# EAGLE design whare hauora sensor r1.2 (EAGLE 7.6.0)
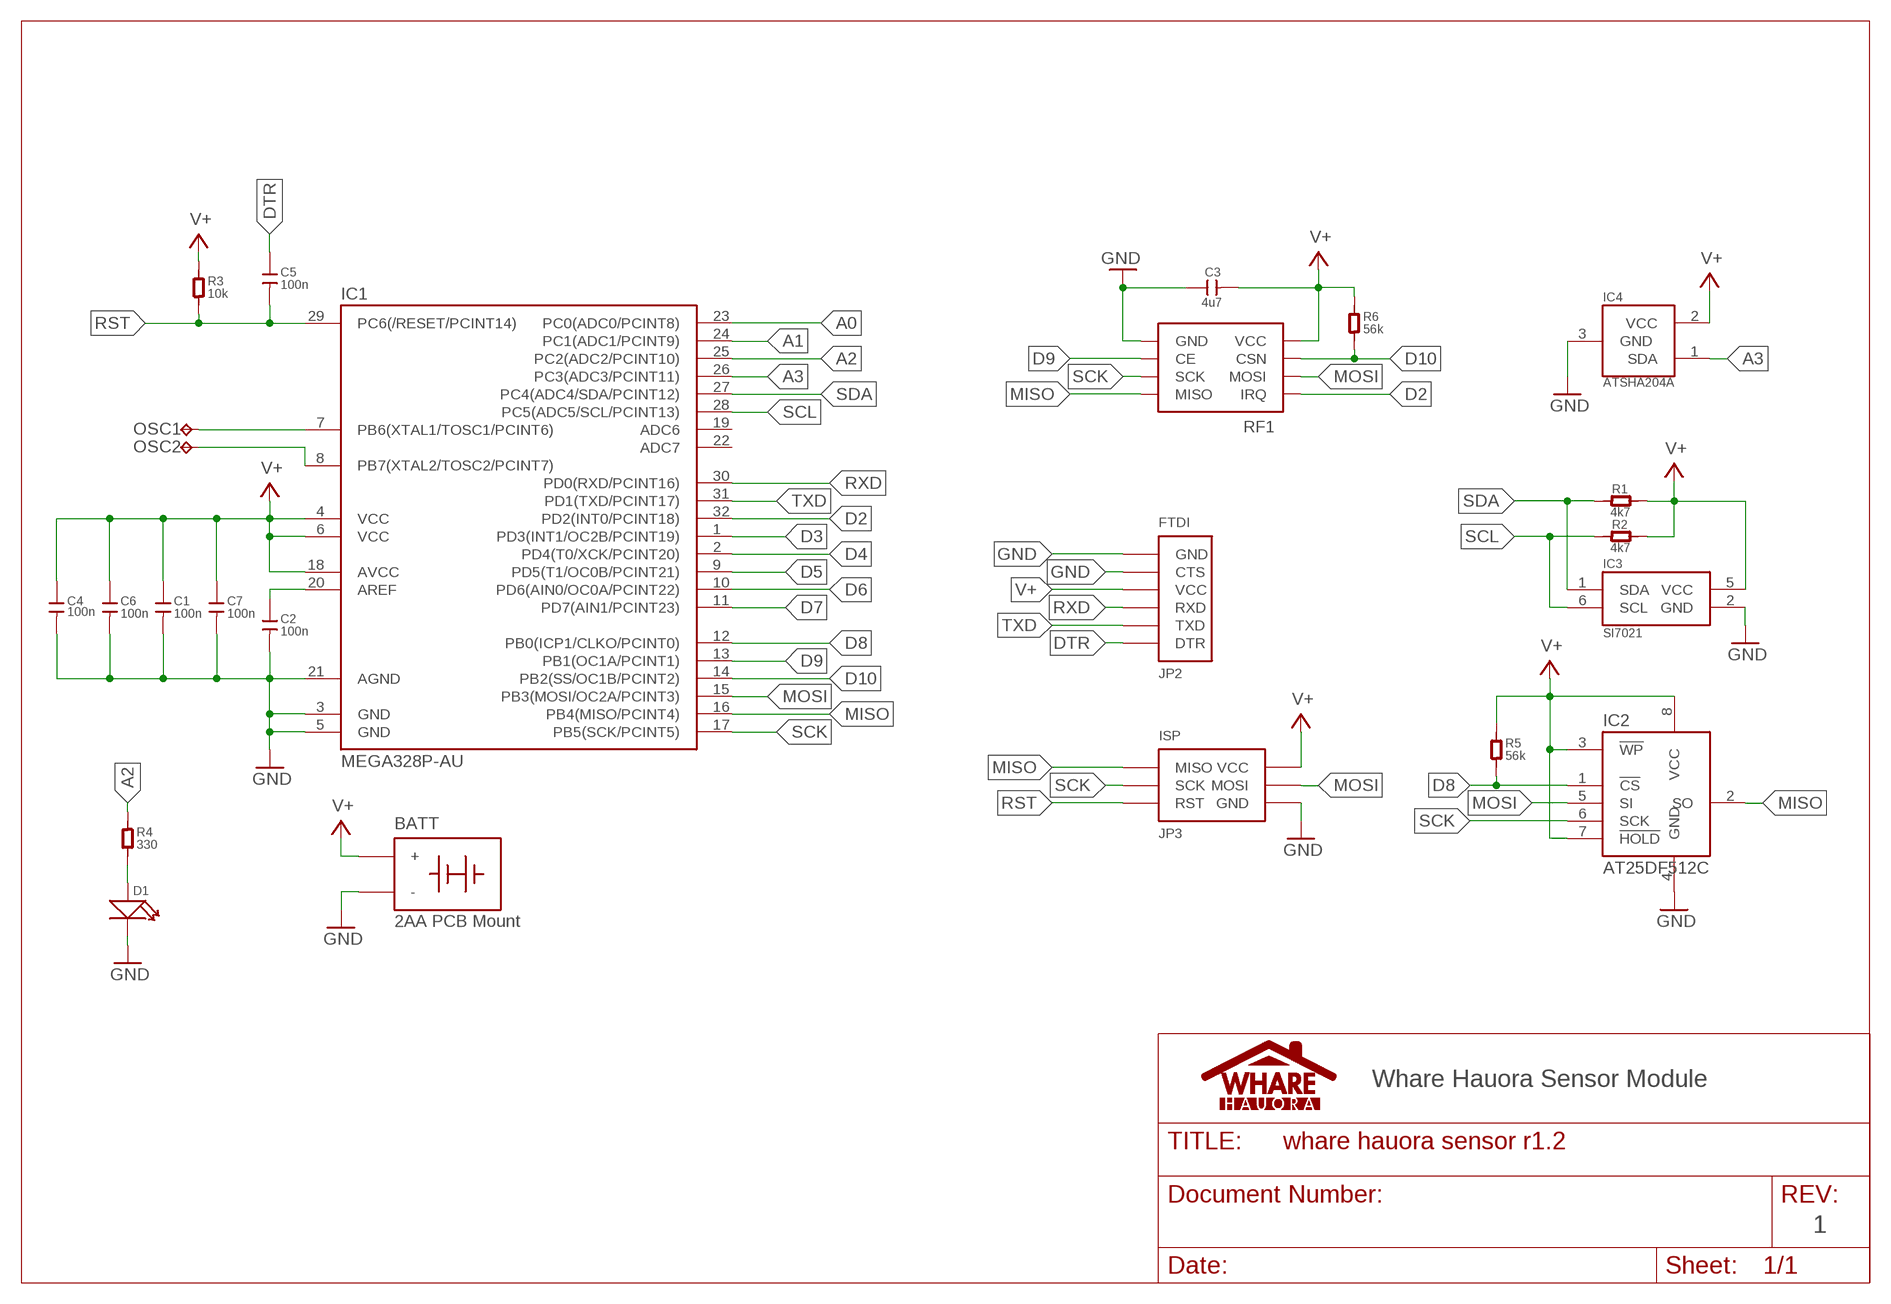
[diagram p0: schematic, sheet 1]

## Parts
BATT  2AA-PACK  [2AA-PACK\]
C1  100n  CAP-0603  [C0603]
C2  100n  CAP-0603  [C0603]
C3  4u7  CAP-0603  [C0603]
C4  100n  CAP-0603  [C0603]
C5  100n  CAP-0603  [C0603]
C6  100n  CAP-0603  [C0603]
C7  100n  CAP-0603  [C0603]
D1  LED-0603  [LED-0603]
IC1  MEGA328P-AU  MEGA48/88/168-AU  [TQFP32-08]
IC2  AT25DF512C  [SO8]
IC3  SI7021  [DFN6]
IC4  ATSHA204A  [SOT23]
JP2  FTDI  [FTDI]
JP3  ISP  [ISP]
OSC1  TPTP10R  [TP10R]
OSC2  TPTP10R  [TP10R]
R1  4k7  R-0603  [R0603]
R2  4k7  R-0603  [R0603]
R3  10k  R-0603  [R0603]
R4  330  R-0603  [R0603]
R5  56k  R-0603  [R0603]
R6  56k  R-0603  [R0603]
RF1  NRF24L01+  [NRF24L01+]

## Nets
A0: IC1.23(PC0(ADC0/PCINT8))
A1: IC1.24(PC1(ADC1/PCINT9))
A2: IC1.25(PC2(ADC2/PCINT10)) R4.1
A3: IC1.26(PC3(ADC3/PCINT11)) IC4.1(SDA)
D2: IC1.32(PD2(INT0/PCINT18)) RF1.P$8(IRQ)
D3: IC1.1(PD3(INT1/OC2B/PCINT19))
D4: IC1.2(PD4(T0/XCK/PCINT20))
D5: IC1.9(PD5(T1/OC0B/PCINT21))
D6: IC1.10(PD6(AIN0/OC0A/PCINT22))
D7: IC1.11(PD7(AIN1/PCINT23))
D8: IC1.12(PB0(ICP1/CLKO/PCINT0)) IC2.1(!CS) R5.1
D9: IC1.13(PB1(OC1A/PCINT1)) RF1.P$3(CE)
D10: IC1.14(PB2(SS/OC1B/PCINT2)) R6.1 RF1.P$4(CSN)
DTR: C5.1 JP2.DTR
GND [Power]: BATT.- C1.2 C2.2 C3.1 C4.2 C6.2 C7.2 D1.- IC1.3(GND) IC1.5(GND) IC1.21(AGND) IC2.4(GND) IC3.2(GND) IC4.3(GND) JP2.CTS JP2.GND JP3.GND RF1.P$1(GND)
MISO: IC1.16(PB4(MISO/PCINT4)) IC2.2(SO) JP3.MISO RF1.P$7(MISO)
MOSI: IC1.15(PB3(MOSI/OC2A/PCINT3)) IC2.5(SI) JP3.MOSI RF1.P$6(MOSI)
N$1: IC1.7(PB6(XTAL1/TOSC1/PCINT6)) OSC1.TP
N$2: IC1.8(PB7(XTAL2/TOSC2/PCINT7)) OSC2.TP
N$3: D1.+ R4.2
N$4: C2.1 IC1.20(AREF)
RST: C5.2 IC1.29(PC6(/RESET/PCINT14)) JP3.RST R3.1
RXD: IC1.30(PD0(RXD/PCINT16)) JP2.RXD
SCK: IC1.17(PB5(SCK/PCINT5)) IC2.6(SCK) JP3.SCK RF1.P$5(SCK)
SCL: IC1.28(PC5(ADC5/SCL/PCINT13)) IC3.6(SCL) R2.1
SDA: IC1.27(PC4(ADC4/SDA/PCINT12)) IC3.1(SDA) R1.1
TXD: IC1.31(PD1(TXD/PCINT17)) JP2.TXD
V+ [Power]: BATT.+ C1.1 C3.2 C4.1 C6.1 C7.1 IC1.4(VCC) IC1.6(VCC) IC1.18(AVCC) IC2.3(!WP) IC2.7(!HOLD) IC2.8(VCC) IC3.5(VCC) IC4.2(VCC) JP2.VCC JP3.VCC R1.2 R2.2 R3.2 R5.2 R6.2 RF1.P$2(VCC)
Unconnected: IC1.19(ADC6) IC1.22(ADC7)

## Notes on the sheet
- Whare Hauora Sensor Module
- 1

## Library data of the parts
BATT = Callum:2AA-PACK: PCB mount dual AA battery holder RS# 611-9598
C1-C7 = Discrete:CAP: Ceramic Capacitors
D1 = Discrete:LED
IC1 = avr-7:MEGA48/88/168
IC2 = Callum:AT25DF512C
IC3 = Sensor:SI7021
IC4 = Sensor:ATSHA204A
JP2 = Callum:FTDI: FTDI Programming Header
JP3 = Callum:ISP
OSC1 OSC2 = testpad:TP: Test pad
R1-R6 = Discrete:R*
RF1 = Callum:NRF24L01+

## Net classes
0 default: width 0.203 mm
1 Power: width 0.406 mm

## Board
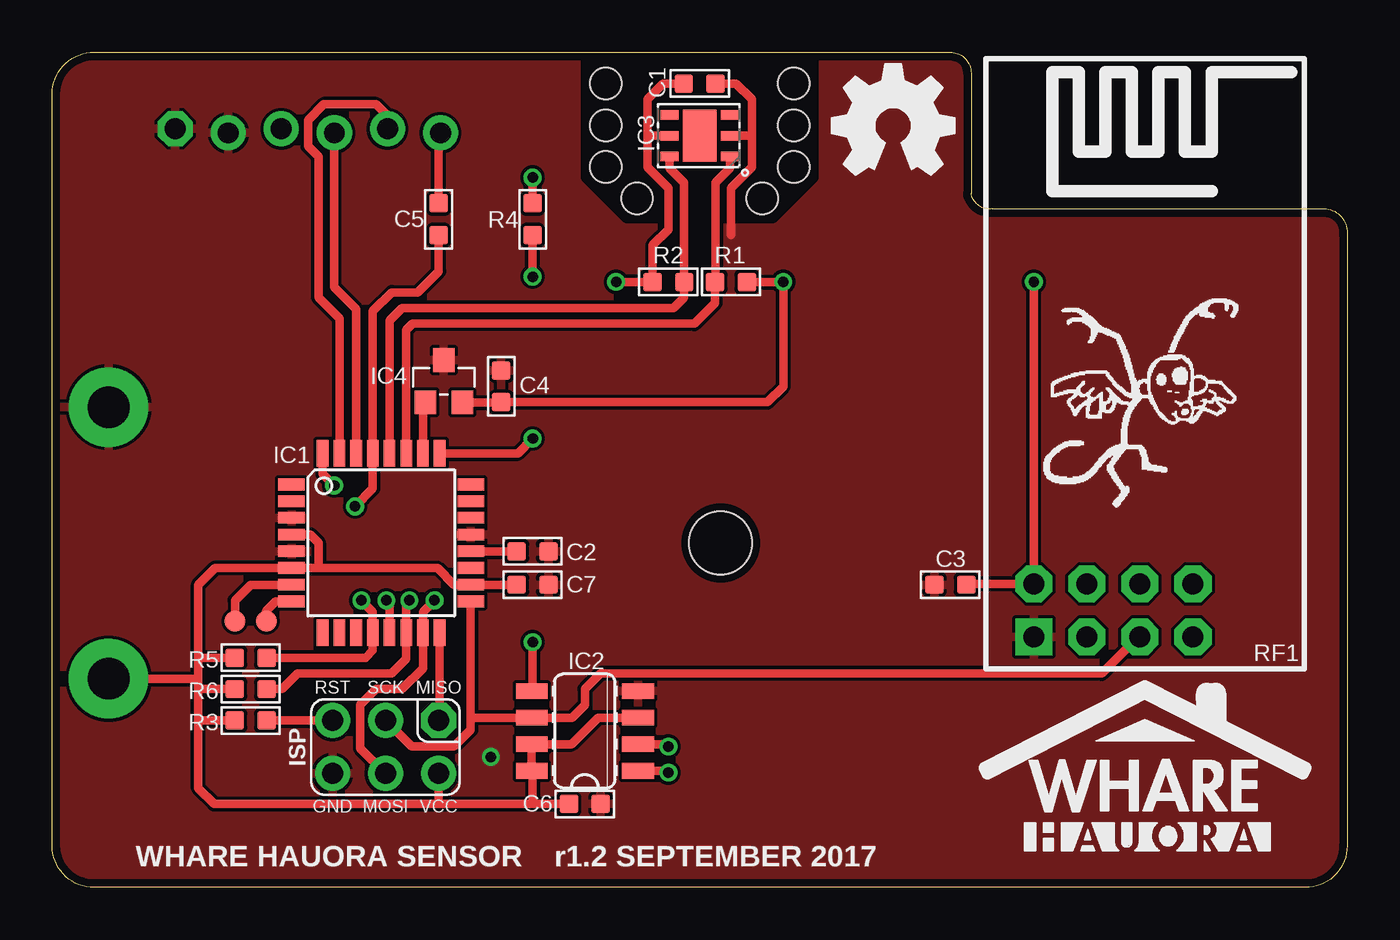
[diagram p1: board, top side]
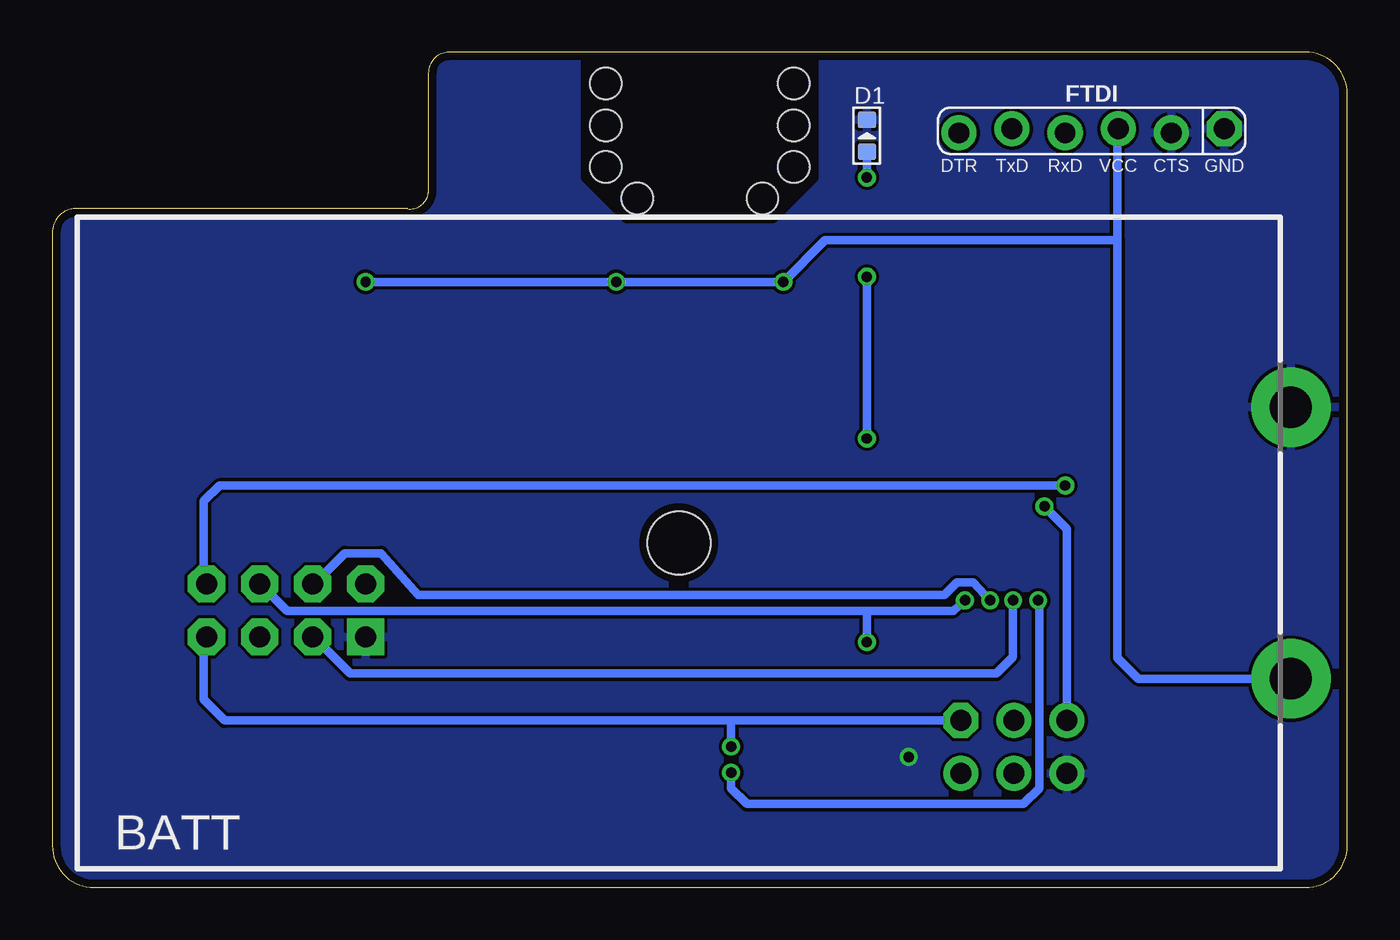
[diagram p2: board, bottom side, seen from below]

Size 62.01 x 40 mm. Coordinates in mm from the lower left corner, seen from the top.
Outline: 0,2 0,38 arc-90 2,40 43,40 arc-90 44,39 44,33.25 arc90 45,32.5 61,32.5 arc-90 62,31.25 62,2 arc-90 60,0 2,0 arc-90 0,2
Copper layers (1*16): Top 0.0356mm / dielectric 1.5011mm / Bottom 0.0356mm
Design rules "OSHpark DRC": minimum track width 6mil, minimum drill 13mil, track to track 6mil, track to pad 6mil, pad to pad 6mil, via to via 6mil, smd to smd 6mil, copper to edge 15mil, drill to drill 6mil, minimum pad ring 7mil, minimum via ring 7mil, stop-mask expansion 3mil, vias tented up to drill 30mil, thermal gap 6mil
Holes 1.5 mm at 35.5,38.5 35.5,36.5 35.5,34.5 26.5,38.5 26.5,36.5 26.5,34.5 28,33 34,33
tRestrict: area 25.5,32 to 36.5,39.8
bRestrict: area 25.5,32 to 36.5,39.8

### Footprints (pad centres in the part's own frame; a part is rotated, then mirrored left to right if it is on the bottom)
2AA-PACK\ = drill 2 pad 3.81: + -29.3,6.5; - -29.3,-6.5 | hole 3: 0,0
C0603 = smd 0.889 x 0.889: 1 -0.762,0; 2 0.762,0
LED-0603 = smd 0.762 x 0.889: + -0.762,0; - 0.762,0
TQFP32-08 = smd 1.27 x 0.559: 1 -4.293,2.8; 2 -4.293,2; 3 -4.293,1.2; 4 -4.293,0.4; 5 -4.293,-0.4; 6 -4.293,-1.2; 7 -4.293,-2; 8 -4.293,-2.8; 17 4.293,-2.8; 18 4.293,-2; 19 4.293,-1.2; 20 4.293,-0.4; 21 4.293,0.4; 22 4.293,1.2; 23 4.293,2; 24 4.293,2.8 | smd 0.559 x 1.27: 9 -2.8,-4.293; 10 -2,-4.293; 11 -1.2,-4.293; 12 -0.4,-4.293; 13 0.4,-4.293; 14 1.2,-4.293; 15 2,-4.293; 16 2.8,-4.293; 25 2.8,4.293; 26 2,4.293; 27 1.2,4.293; 28 0.4,4.293; 29 -0.4,4.293; 30 -1.2,4.293; 31 -2,4.293; 32 -2.8,4.293
SO8 = smd 1.524 x 0.762: 1 -2.54,1.905; 2 -2.54,0.635; 3 -2.54,-0.635; 4 -2.54,-1.905; 5 2.54,-1.905; 6 2.54,-0.635; 7 2.54,0.635; 8 2.54,1.905
DFN6 = smd 0.85 x 0.45: 1 -1.45,1; 2 -1.45,0; 3 -1.45,-1; 4 1.45,-1; 5 1.45,0; 6 1.45,1 | smd 1.6 x 2.5: P$1 0,0
SOT23 = smd 1.016 x 1.143: 1 -0.889,-1.016; 2 0.889,-1.016; 3 0,1.016
FTDI = drill 1 pad 1.676: CTS 2.54,0; DTR 12.7,0; RXD 7.62,0; TXD 10.16,-0.2; VCC 5.08,-0.2 | drill 1 pad 1.676 octagon: GND 0,-0.2
ISP = drill 1 pad 1.676: GND 2.54,-5.08; MOSI 2.54,-2.54; RST 0,-5.08; SCK 0,-2.54; VCC 2.54,0 | drill 1 pad 1.676 octagon: MISO 0,0
TP10R = smd 1 x 1: TP 0,0
R0603 = smd 0.889 x 0.889: 1 0,0.762; 2 0,-0.762
NRF24L01+ = drill 1 pad 1.778 square: P$1 0,0 | drill 1 pad 1.778 octagon: P$2 -2.54,0; P$3 0,2.54; P$4 -2.54,2.54; P$5 0,5.08; P$6 -2.54,5.08; P$7 0,7.62; P$8 -2.54,7.62

### Placement (x,y rotation side)
BATT  32,16.5 180 bottom
C1  31,38.5 0 top
C2  23,16.1 0 top
C3  43,14.5 0 top
C4  21.5,24 90 top
C5  18.5,32 270 top
C6  25.5,4 0 top
C7  23,14.5 0 top
D1  23,36 90 bottom
IC1  15.75,16.5 0 top
IC2  25.5,7.5 180 top
IC3  31,36 180 top
IC4  18.75,24.25 0 top
JP2  5.89,36.13 180 bottom
JP3  18.5,8 270 top
OSC1  8.75,12.75 0 top
OSC2  10.25,12.75 0 top
R1  32.5,29 90 top
R2  29.5,29 270 top
R3  9.5,8 270 top
R4  23,32 180 top
R5  9.5,11 270 top
R6  9.5,9.5 270 top
RF1  47,12 270 top
U$1  [OSHW-LOGO]  40.25,36.5 0 top
U$2  [WHAREHAUORA-SMALL]  52.5,5.75 0 top
U$3  [MONKEY]  52,23 0 top

### Tracks (layer width: path | path; a pad name or v marks a point on that pad's centre or on a via)
A2  (via drill 0.5)
  Top 0.406: IC1.25 22.29,20.79 v23,21.5 | v23,29.25 R4.1
  Bottom 0.406: v23,21.5 v23,29.25
A3
  Top 0.406: IC1.26 17.75,23.12 IC4.1
D2  (via drill 0.5)
  Top 0.406: IC1.32 12.95,19.8 v13.5,19.25
  Bottom 0.406: v13.5,19.25 54,19.25 54.75,18.5 54.75,14.66 RF1.P$8
D8  (via drill 0.5)
  Top 0.406: R5.1 15,11 15.35,11.35 IC1.12 15.35,13.2 v14.8,13.75 | IC2.1 29.41,5.59 v29.5,5.5
  Bottom 0.406: 14.8,13.7 v14.8,13.75 14.75,13.7 14.75,4.75 15.5,4 28.75,4 29.5,4.75 v29.5,5.5
D9  (via drill 0.5)
  Top 0.406: IC1.13 16.15,13.6 v16,13.75
  Bottom 0.406: RF1.P$3 49.5,12 47.75,10.25 16.8,10.25 16,11.05 v16,13.75
D10  (via drill 0.5)
  Top 0.406: R6.1 11,9.5 11.75,10.25 16.25,10.25 16.95,10.95 IC1.14 16.95,13.6 v17.1,13.75
  Bottom 0.406: RF1.P$4 49.46,14.54 48,16 46.25,16 44.5,14 19.3,14 18.7,14.6 17.9,14.6 v17.1,13.75
DTR
  Top 0.406: C5.1 18.5,36.05 JP2.DTR
GND  (via drill 0.5)
  Top 0.406: 33.5,36 33.5,37.75 32.75,38.5 C1.2 | 33.5,36 33.5,34.5 32.5,33.5 32.5,31.25 | IC3.2 33.5,36
  other vias: 21,6.25
  pour Top: 0,0 62,0 62,32.5 44,32.5 44,40 0,40
  pour Bottom: 0,40 44,40 44,32.5 62,32.5 62,0 0,0
MISO  (via drill 0.5)
  Top 0.406: IC1.16 18.55,8.05 JP3.MISO | IC2.2 29.39,6.87 v29.5,6.75
  Bottom 0.406: JP3.MISO 29.5,8 | 29.5,8 53.75,8 54.75,9 54.75,11.87 RF1.P$7 | 29.5,8 v29.5,6.75
MOSI  (via drill 0.5)
  Top 0.406: JP3.MOSI 14.75,6.67 14.75,8.75 15.5,9.5 16.75,9.5 17.75,10.5 IC1.15 17.75,13.2 v18.3,13.75 | v23,11.75 23,9.45 IC2.5
  Bottom 0.406: RF1.P$6 52.04,14.54 50.75,13.25 23,13.25 | 23,13.25 18.85,13.25 v18.3,13.75 | v23,11.75 23,13.25
N$1
  Top 0.406: IC1.7 9.5,14.5 8.75,13.75 OSC1.TP
N$2
  Top 0.406: IC1.8 10.7,13.7 10.25,13.25 OSC2.TP
N$3  (via drill 0.5)
  Top 0.406: 23,32.74 R4.2 v23,34
  Bottom 0.406: 22.99,35.27 D1.+ v23,34
N$4
  Top 0.406: IC1.20 C2.1
RST  (via drill 0.5)
  Top 0.406: C5.2 18.5,29.5 17.5,28.5 16.25,28.5 15.35,27.6 IC1.29 15.35,19.1 v14.5,18.25 | R3.1 JP3.RST
  Bottom 0.406: JP3.RST 13.42,17.17 v14.5,18.25
RXD
  Top 0.406: IC1.30 14.55,27.7 13.5,28.75 JP2.RXD
SCK
  Top 0.406: IC1.17 20.04,8.13 | JP3.SCK 17.21,6.75 19.25,6.75 20.04,7.54 20.04,8.13 | 20.04,8.13 IC2.6 24.89,8.13 25.5,8.75 25.5,9.5 26.25,10.25 50.25,10.25 52,12 RF1.P$5
SCL
  Top 0.406: IC3.6 29.55,34.45 30.25,33.75 30.25,29.01 | 30.25,29.01 R2.1 | 30.25,29.01 30.25,28.25 29.75,27.75 16.75,27.75 16.15,27.15 IC1.28
SDA
  Top 0.406: IC3.1 32.45,34.45 31.75,33.75 31.75,29.01 R1.1 31.74,27.99 30.75,27 17.25,27 16.95,26.7 IC1.27
TXD
  Top 0.406: JP2.TXD 16.05,36.95 15.5,37.5 13,37.5 12.25,36.75 12.25,35.5 12.75,35 12.75,28.25 13.75,27.25 IC1.31
V+  (via drill 0.5)
  Top 0.406: C1.1 29.25,38.5 28.5,37.75 28.5,36 | 28.5,36 28.5,34.5 29.5,33.5 29.5,31.5 28.75,30.75 28.75,29.01 R2.2 v27,29 | IC3.5 28.5,36 | IC4.2 C4.1 34.24,23.24 35,24 v35,29 R1.2 | 12.75,15.3 IC1.6 7.8,15.3 7,14.5 7,11 | 12.75,15.3 18.45,15.3 19.25,14.5 IC1.18 C7.1 | IC1.4 12.35,16.9 12.75,16.5 12.75,15.3 | C3.2 43.8,14.54 RF1.P$2 v47,29 | 8.75,7.99 R3.2 7,8 | IC2.3 26.14,8.13 24.86,6.87 IC2.7 IC2.8 23,5.59 23,4 | 18.5,4 7.75,4 7,4.75 7,8 | 18.5,4 23,4 | 23,4 C6.1 | JP3.VCC 18.5,4 | 7,8 7,9.5 | 7,9.5 7,10 | 7,10 7,11 | R6.2 7,9.5 | R5.2 7,11 | BATT.+ 7,10
  Bottom 0.406: 11,31 25,31 v27,29 v35,29 v47,29 | 11,31 11,36.1 JP2.VCC | 11,31 11,11 10,10 BATT.+

### Text on the board
tPlace: WHARE HAUORA SENSOR | r1.2 SEPTEMBER 2017
tDocu: COMPONENT REFERENCE | 0.1u | SI7021 | 0.1u | 330 | 4k7 | 4k7 | ATSHA204A | 0.1u | MEGA328P | 0.1u | 0.1u | 4u7 | 56k | 56k | 10k | 0.1u